# EAGLE design wx_station_sensors (EAGLE 4.16)
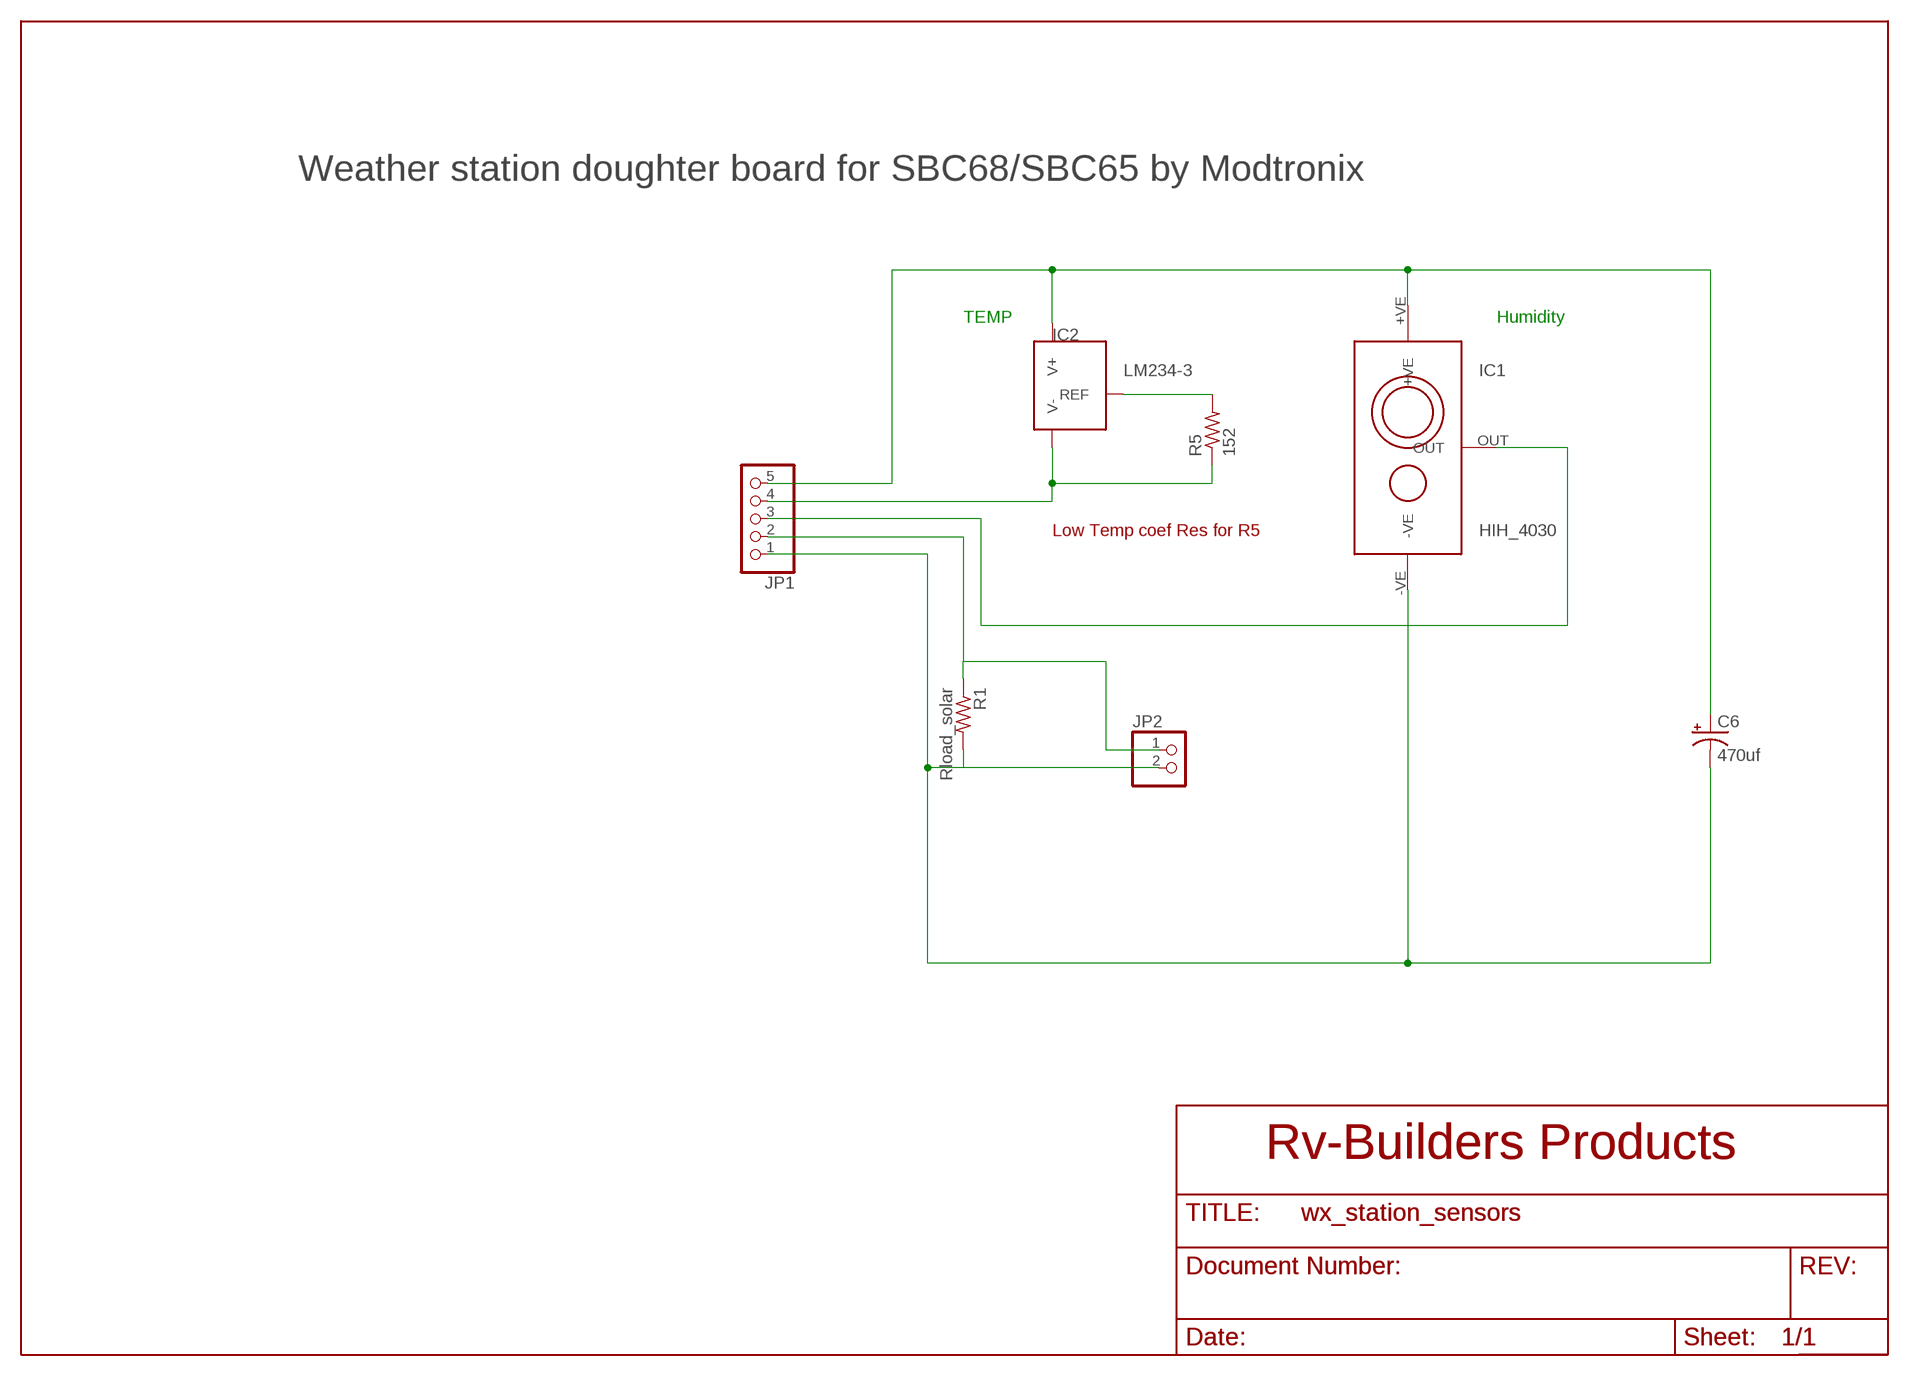
[diagram p0: schematic, sheet 1]

## Parts
C6  470uf  CPOL-USE3.5-10  [E3,5-10]
IC1  HIH_4030  [HIH_4030]
IC2  LM234-3  LM334  [TO92-]
JP1  PINHD-1X5  [1X05]
JP2  PINHD-1X2  [1X02]
R1  Rload_solar  R-US_0207/10  [0207/10]
R5  152  R-US_0207/10  [0207/10]

## Nets
+5V: C6.+ IC1.+VE IC2.3(V+) JP1.5
GND: C6.- IC1.-VE JP1.1 JP2.2 R1.2
HYG_OUT: IC1.OUT JP1.3
N$1: IC2.1(V-) JP1.4 R5.1
N$12: IC2.2(REF) R5.2
N$16: JP1.2 JP2.1 R1.1

## Notes on the sheet
- Weather station doughter board for SBC68/SBC65 by Modtronix
- TEMP | Humidity
- Low Temp coef Res for R5

## Library data of the parts
C6 = rcl:CPOL-US: POLARIZED CAPACITOR, American symbol
IC1 = ZStofer:HIH_4030
IC2 = Stofer:LM334
JP1 = Headers:PINHD-1X5: PIN HEADER
JP2 = Headers:PINHD-1X2: PIN HEADER
R1 R5 = rcl:R-US_: RESISTOR, American symbol

## Board
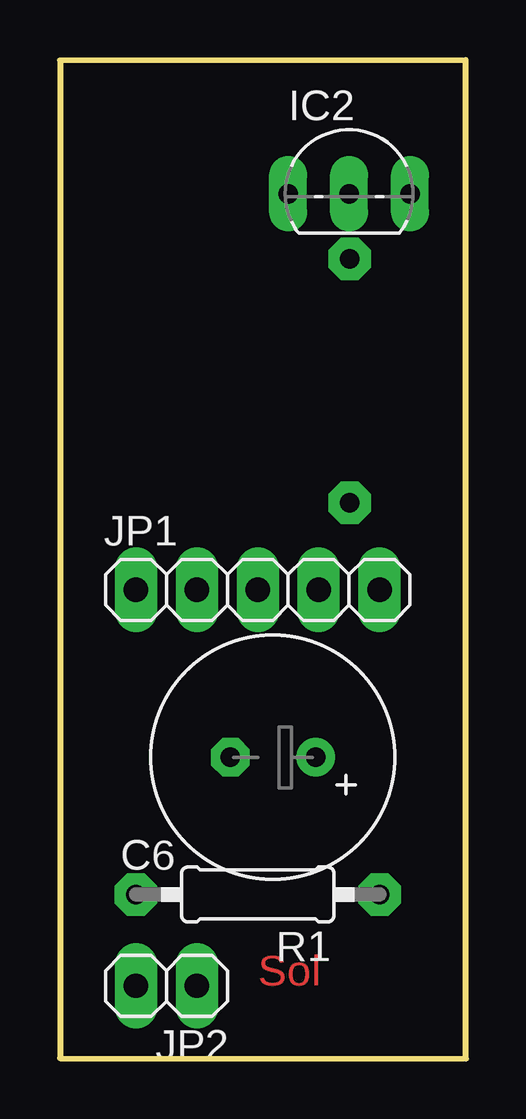
[diagram p1: board, top side]
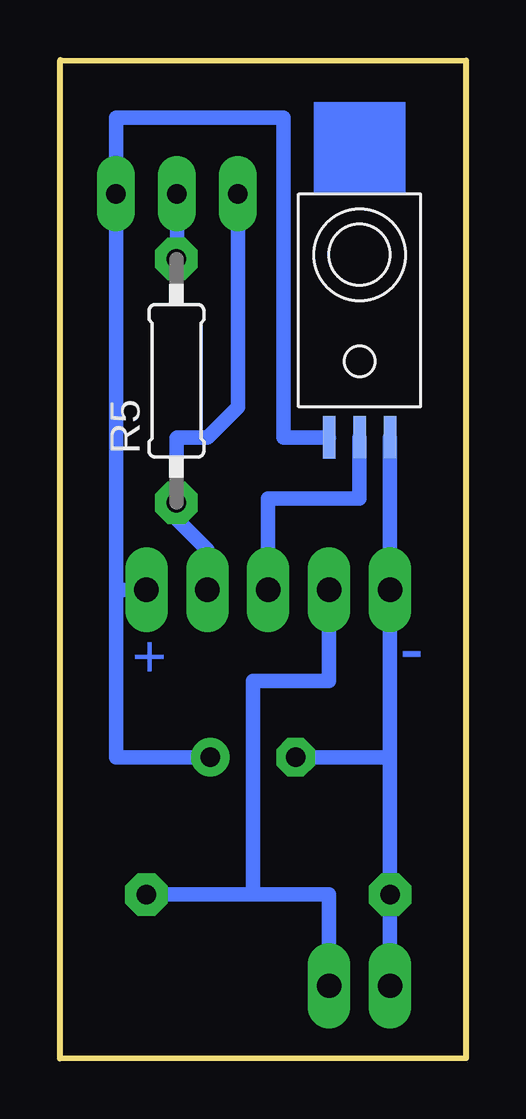
[diagram p2: board, bottom side, seen from below]

Size 16.94 x 41.63 mm. Coordinates in mm from the lower left corner, seen from the top.
Outline: 0,0.02 16.94,0 16.92,41.63 0,41.6 0,0.02
Copper layers (1*2+15*16): Top 0.035mm / dielectric 0.2mm / Route2 0.035mm / dielectric 0.15mm / Route15 0.035mm / dielectric 0.2mm / Bottom 0.035mm
Design rules "default": minimum track width 10mil, minimum drill 24mil, track to track 8mil, track to pad 8mil, pad to pad 8mil, via to via 8mil, smd to smd 8mil, copper to edge 40mil, drill to drill 8mil, minimum pad ring 15mil, minimum via ring 15mil, stop-mask expansion 4mil, vias tented up to drill 0mil, thermal gap 10mil

### Footprints (pad centres in the part's own frame; a part is rotated, then mirrored left to right if it is on the bottom)
E3,5-10 = drill 0.813 pad 1.6 round: + -1.778,0 | drill 0.813 pad 1.6 octagon: - 1.778,0
HIH_4030 = smd 0.508 x 1.778: +VE -1.27,0; -VE 1.27,0; OUT 0,0
TO92- = drill 0.813 long: 1 -2.54,-1.27; 2 0,-1.27; 3 2.54,-1.27
1X05 = drill 1.016 long: 1 -5.08,0; 2 -2.54,0; 3 0,0; 4 2.54,0; 5 5.08,0
1X02 = drill 1.016 long: 1 -1.27,0; 2 1.27,0
0207/10 = drill 0.813 pad 1.778 octagon: 1 -5.08,0; 2 5.08,0

### Placement (x,y rotation side)
C6  8.88,12.56 180 top
IC1  4.44,25.89 0 bottom
IC2  12.06,37.32 0 top
JP1  8.25,19.54 0 top
JP2  4.44,3.03 180 top
R1  8.25,6.84 180 top
R5  12.08,28.25 90 bottom

### Tracks (layer width: path | path; a pad name or v marks a point on that pad's centre or on a via)
+5V
  Bottom 0.61: C6.+ 14.6,12.56 14.6,19.54 | IC1.+VE 7.62,25.89 7.62,39.23 14.6,39.23 IC2.3 14.6,19.54 | JP1.5 14.6,19.54
GND
  Bottom 0.61: IC1.-VE JP1.1 3.17,12.56 | 3.17,12.56 C6.- | 3.17,12.56 R1.2 JP2.2
HYG_OUT
  Bottom 0.61: JP1.3 8.25,23.35 4.44,23.35 IC1.OUT
N$1
  Bottom 0.61: 12.12,22.54 12.14,22.55 | 12.12,22.54 R5.1 12.08,25.87 12.06,25.89 10.79,25.89 9.52,27.16 IC2.1 | JP1.4 10.79,21.2 12.12,22.54
N$12
  Bottom 0.61: R5.2 12.06,33.33 IC2.2
N$16
  Bottom 0.61: JP1.2 5.71,15.73 8.88,15.73 8.88,6.84 | 12.06,6.84 R1.1 8.88,6.84 | JP2.1 5.71,6.84 8.88,6.84

### Text on the board
Top: Sol
Bottom: - | +